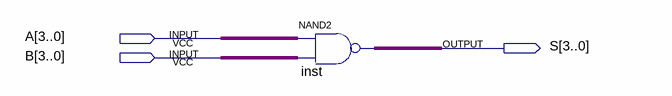
[diagram p0: schematic sheet]
// Quartus schematic NAND4BIT.bdf as structural Verilog: 1 symbols, 3 pins
module NAND4BIT (
  input  [3:0] A,
  input  [3:0] B,
  output [3:0] S
);

  assign S = ~(A & B);  // NAND2 inst, 4 bits wide
endmodule
